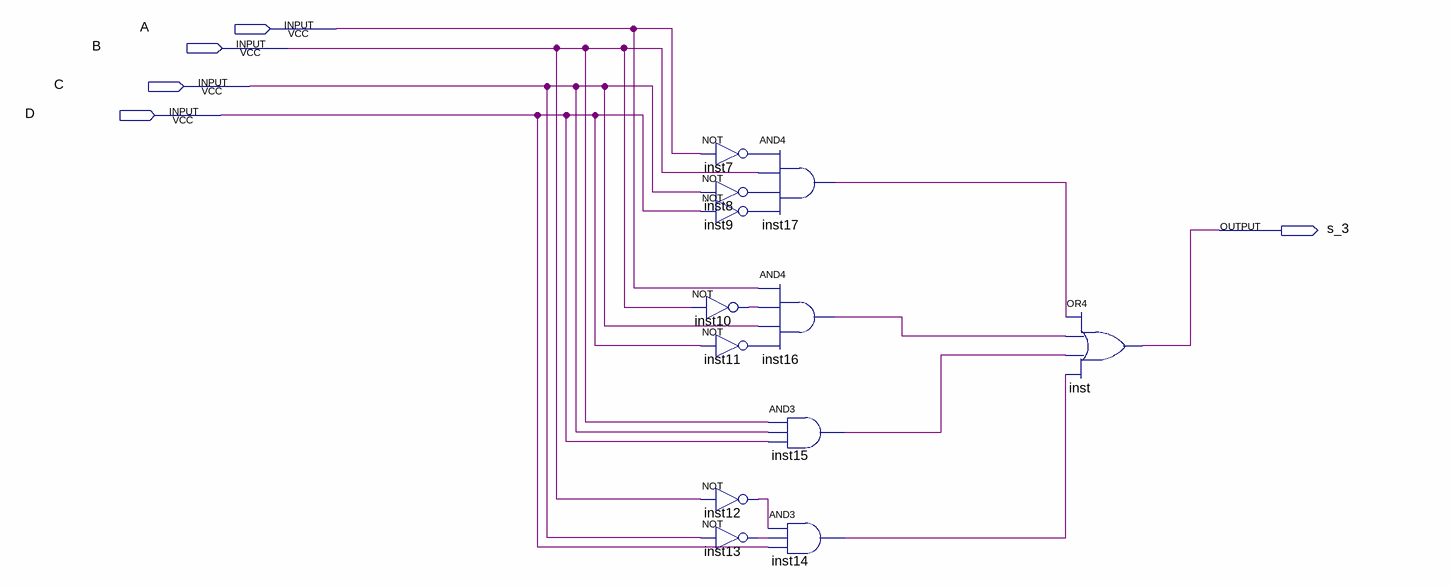
[diagram p0: schematic sheet]
// Quartus schematic s_3.bdf as structural Verilog: 12 symbols, 5 pins
module s_3 (
  input  A,
  input  B,
  input  C,
  input  D,
  output s_3
);

  wire inst7_out, inst8_out, inst9_out, inst10_out, inst11_out, inst12_out, inst13_out, inst14_out,
       inst15_out, inst16_out, inst17_out;

  not inst7 (inst7_out, A);
  not inst8 (inst8_out, C);
  not inst9 (inst9_out, D);
  not inst10 (inst10_out, B);
  not inst11 (inst11_out, D);
  not inst12 (inst12_out, B);
  not inst13 (inst13_out, C);
  and inst17 (inst17_out, inst7_out, B, inst8_out, inst9_out);
  and inst16 (inst16_out, A, inst10_out, C, inst11_out);
  and inst15 (inst15_out, B, C, D);
  and inst14 (inst14_out, inst12_out, inst13_out, D);
  or inst (s_3, inst17_out, inst16_out, inst15_out, inst14_out);
endmodule
